# Altium schematic sheet dc-1.SchDoc
size A
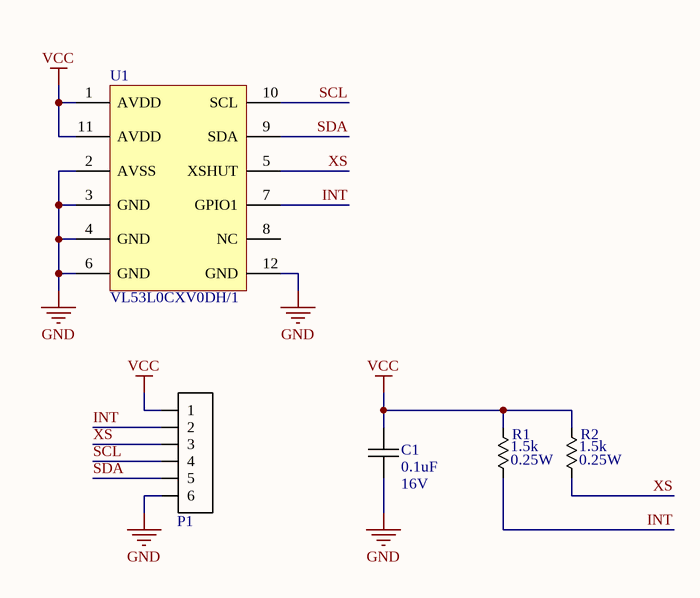
[diagram p0: dc-1.SchDoc]

## Parts
C1  Capacitance: 0.1uF  Voltage Rating: 16V  [chip_0603]  (hidden comment: cap_single_np)
P1  conn-6x1_0  [HDDR_6x1_RA]  (value not drawn)
R1  Resistance: 1.5k  Power Rating: 0.25W  [chip_0603]  (hidden comment: res_single)
R2  Resistance: 1.5k  Power Rating: 0.25W  [chip_0603]  (hidden comment: res_single)
U1  Manufacturer PN: VL53L0CXV0DH/1  [VL53L0X]  (hidden comment: VL53L0X)

## Nets
GND: C1.2 P1.6 U1.2(AVSS) U1.3(GND) U1.4(GND) U1.6(GND) U1.12(GND)
VCC: C1.1 P1.1 R1.1 R2.1 U1.1(AVDD) U1.11(AVDD)
INT: P1.2 R1.2 U1.7(GPIO1)
SCL: P1.4 U1.10(SCL)
SDA: P1.5 U1.9(SDA)
XS: P1.3 R2.2 U1.5(XSHUT)

Not connected (* = marked no-connect by the designer): U1 8(NC)

## Library data of the parts
C1 = CAP-00542: CAP, 0.1uF, ±10%, 16V, X7R, 0603; Manufacturer: Murata; Tolerance: ±10%; Part Number: CAP-00542; Type: X7R
P1 = CONN-00050: Header, 6x1, 0.1", Right-Angle; Manufacturer: Samtec; Manufacturer PN: TSW-106-08-F-S-RA; Positions per level: 6; Levels: 1; Part Number: CONN-00050; Type: Header; Cost: 0.54
R1 R2 = RES-00284: RES SMD 1.5K OHM 1% 1/4W 0603; Manufacturer: Panasonic; Manufacturer PN: ERJ-PA3F1501V; Tolerance: 1%; Part Number: RES-00284
U1 = MISC-00028: Time-of-Flight Ranging Sensor, VL53L0X; Manufacturer: ST; Part Number: MISC-00028; Cost: 5.36